# EAGLE design pcb-expérience (EAGLE 9.3.2)
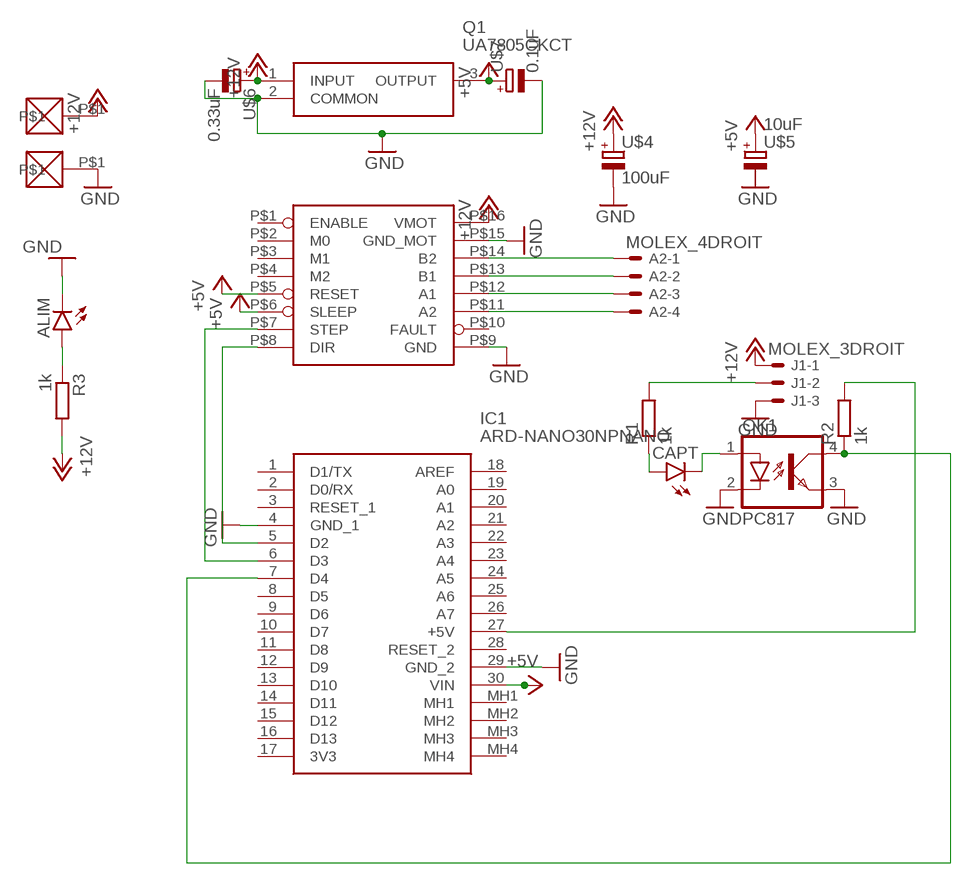
[diagram p0: schematic, sheet 1]

## Parts
A2  MOLEX_4DROIT  [CON_4_DROIT]
ALIM  LED5MM  [LED5MM]
CAPT  LED5MM  [LED5MM]
IC1  ARD-NANO30NPNANO  [ARDNANO30NP]
J1  MOLEX_3DROIT  [CON_3_DROIT]
OK1  PC817  [DIL04]
Q1  UA7805CKCT  [TO254P465X1016X1883-3P]
R1  1k  R-EU_0207/2V  [0207/2V]
R2  1k  R-EU_0207/7  [0207/7]
R3  1k  R-EU_0207/2V  [0207/2V]
U$1  DRV8825  [DRV8825]
U$2  BAT_WIRE_SOLD  [LARGE_PAD_BATT]
U$3  BAT_WIRE_SOLD  [LARGE_PAD_BATT]
U$4  100uF  CONDO3.5-8  [E3,5-8]
U$5  10uF  CONDO2-5  [E2-5]
U$6  0.33uF  CONDO2-5  [E2-5]
U$7  0.1uF  CONDO2-5  [E2-5]

## Nets
+5V: IC1.30(VIN) Q1.3(OUTPUT) U$1.P$5(RESET) U$1.P$6(SLEEP) U$5.+ U$7.+
+12V: J1.1 Q1.1(INPUT) R3.2 U$1.P$16(VMOT) U$2.P$1 U$4.+ U$6.+
GND: ALIM.K(C) IC1.4(GND_1) IC1.29(GND_2) J1.3 OK1.2(C) OK1.3(EMIT) Q1.2(COMMON) U$1.P$9(GND) U$1.P$15(GND_MOT) U$3.P$1 U$4.- U$6.- U$7.-
N$1: J1.2 R1.2
N$2: IC1.7(D4) OK1.4(COL) R2.1
N$3: IC1.27(+5V) R2.2
N$4: A2.4 U$1.P$11(A2)
N$5: A2.3 U$1.P$12(A1)
N$6: A2.2 U$1.P$13(B1)
N$7: A2.1 U$1.P$14(B2)
N$8: ALIM.A R3.1
N$9: CAPT.K(C) OK1.1(A)
N$10: CAPT.A R1.1
N$12: IC1.5(D2) U$1.P$8(DIR)
N$13: IC1.6(D3) U$1.P$7(STEP)
Unconnected: IC1.1(D1/TX) IC1.2(D0/RX) IC1.3(RESET_1) IC1.8(D5) IC1.9(D6) IC1.10(D7) IC1.11(D8) IC1.12(D9) IC1.13(D10) IC1.14(D11) IC1.15(D12) IC1.16(D13) IC1.17(3V3) IC1.18(AREF) IC1.19(A0) IC1.20(A1) IC1.21(A2) IC1.22(A3) IC1.23(A4) IC1.24(A5) IC1.25(A6) IC1.26(A7) IC1.28(RESET_2) IC1.MH1 IC1.MH2 IC1.MH3 IC1.MH4 U$1.P$1(ENABLE) U$1.P$2(M0) U$1.P$3(M1) U$1.P$4(M2) U$1.P$10(FAULT) U$5.-

## Library data of the parts
A2 = AREA:MOLEX_4: CONNECTOR wire to board 2.54 mm (.1 inch) pitch header; MF: MOLEX; OC_FARNELL: unknown; OC_NEWARK: unknown
ALIM CAPT = led:LED: LED OSRAM: - CHIPLED LG R971, LG N971, LY N971, LG Q971, LY Q971, LO R971, LY R971 LH N974, LH R974 LS Q976, LO Q976, LY Q976 LO Q996 - Hyper CHIPLED LW Q18S LB Q993, LB Q99A, LB R99A - SideLED LS A670, LO A670, LY A670, LG A670, LP A670 LB A673, LV A673, LT A673, LW A673 LH A674 LY A675 LS A676, LA A676, LO A676, LY A676, LW A676 LS A679, LY A679, LG A679 - Hyper Micro SIDELED® LS Y876, LA Y876, LO Y876, LY Y876 LT Y87S - SmartLED LW L88C, LW L88S LB L89C, LB L89S, LG L890 LS L89K, LO L89K, LY L89K LS L896, LA L896, LO L896, LY L896 - TOPLED LS T670, LO T670, LY T670, LG T670, LP T670 LSG T670, LSP T670, LSY T670, LOP T670, LYG T670 LG T671, LOG T671, LSG T671 LB T673, LV T673, LT T673, LW T673 LH T674 LS T676, LA T676, LO T676, LY T676, LB T676, LH T676, LSB T676, LW T676 LB T67C, LV T67C, LT T67C, LS T67K, LO T67K, LY T67K, LW E67C LS E67B, LA E67B, LO E67B, LY E67B, LB E67C, LV E67C, LT E67C LW T67C LS T679, LY T679, LG T679 LS T770, LO T770, LY T770, LG T770, LP T770 LB T773, LV T773, LT T773, LW T773 LH T774 LS E675, LA E675, LY E675, LS T675 LS T776, LA T776, LO T776, LY T776, LB T776 LHGB T686 LT T68C, LB T68C - Hyper Mini TOPLED® LB M676 - Mini TOPLED Santana® LG M470 LS M47K, LO M47K, LY M47K Source: http://www.osram.convergy.de LUXEON: - LUMILED® LXK2-PW12-R00, LXK2-PW12-S00, LXK2-PW14-U00, LXK2-PW14-V00 LXK2-PM12-R00, LXK2-PM12-S00, LXK2-PM14-U00 LXK2-PE12-Q00, LXK2-PE12-R00, LXK2-PE12-S00, LXK2-PE14-T00, LXK2-PE14-U00 LXK2-PB12-K00, LXK2-PB12-L00, LXK2-PB12-M00, LXK2-PB14-N00, LXK2-PB14-P00, LXK2-PB14-Q00 LXK2-PR12-L00, LXK2-PR12-M00, LXK2-PR14-Q00, LXK2-PR14-R00 LXK2-PD12-Q00, LXK2-PD12-R00, LXK2-PD12-S00 LXK2-PH12-R00, LXK2-PH12-S00 LXK2-PL12-P00, LXK2-PL12-Q00, LXK2-PL12-R00 Source: www.luxeon.com KINGBRIGHT: KA-3528ASYC Source: www.kingbright.com
IC1 = AREA:ARD-NANO30NP: Development Boards & Kits - AVR Arduino Nano 3.1 W/ATMEGA328 NO-PIN Source: Datasheet <http://www.mouser.com/datasheet/2/595/Arduino_Nano3_0-220057.pdf>; DESCRIPTION: Development Boards & Kits - AVR Arduino Nano 3.1 W/ATMEGA328 NO-PIN; HEIGHT: 5mm; MANUFACTURER_NAME: Gravitech; MANUFACTURER_PART_NUMBER: ARD-NANO30NP; MOUSER_PART_NUMBER: 992-ARD-NANO30NP; MOUSER_PRICE-STOCK: https://www.mouser.com/Search/Refine.aspx?Keyword=992-ARD-NANO30NP
J1 = AREA:MOLEX_3: CONNECTOR wire to board 2.54 mm (.1 inch) pitch header; MF: MOLEX; OC_FARNELL: unknown; OC_NEWARK: unknown
OK1 = AREA:PC817: SHARP OPTO COUPLER; MPN: PC817X4J000F; OC_FARNELL: 9707727; OC_NEWARK: 97K7059
Q1 = AREA:UA7805CKCT: Linear Voltage Regulator 5V 1.5A TO-220 Texas Instruments UA78xx UA7805CKCT, Single Linear Voltage Regulator, 1.5A 5 V, 3-Pin TO-220 Source: Datasheet <http://www.ti.com/lit/ds/symlink/ua7805.pdf>; DESCRIPTION: Linear Voltage Regulator 5V 1.5A TO-220 Texas Instruments UA78xx UA7805CKCT, Single Linear Voltage Regulator, 1.5A 5 V, 3-Pin TO-220; HEIGHT: 4.65mm; MANUFACTURER_NAME: Texas Instruments; MANUFACTURER_PART_NUMBER: UA7805CKCT; MOUSER_PART_NUMBER: 595-UA7805CKCT; MOUSER_PRICE-STOCK: https://www.mouser.com/Search/Refine.aspx?Keyword=595-UA7805CKCT; RS_PART_NUMBER: 8100161; RS_PRICE-STOCK: http://uk.rs-online.com/web/p/products/8100161
R1-R3 = rcl:R-EU_: RESISTOR, European symbol; SPICEPREFIX: R
U$1 = AREA:DRV8825
U$2 U$3 = AREA:BAT_WIRE_SOLD
U$4-U$7 = AREA:CONDO

## Board
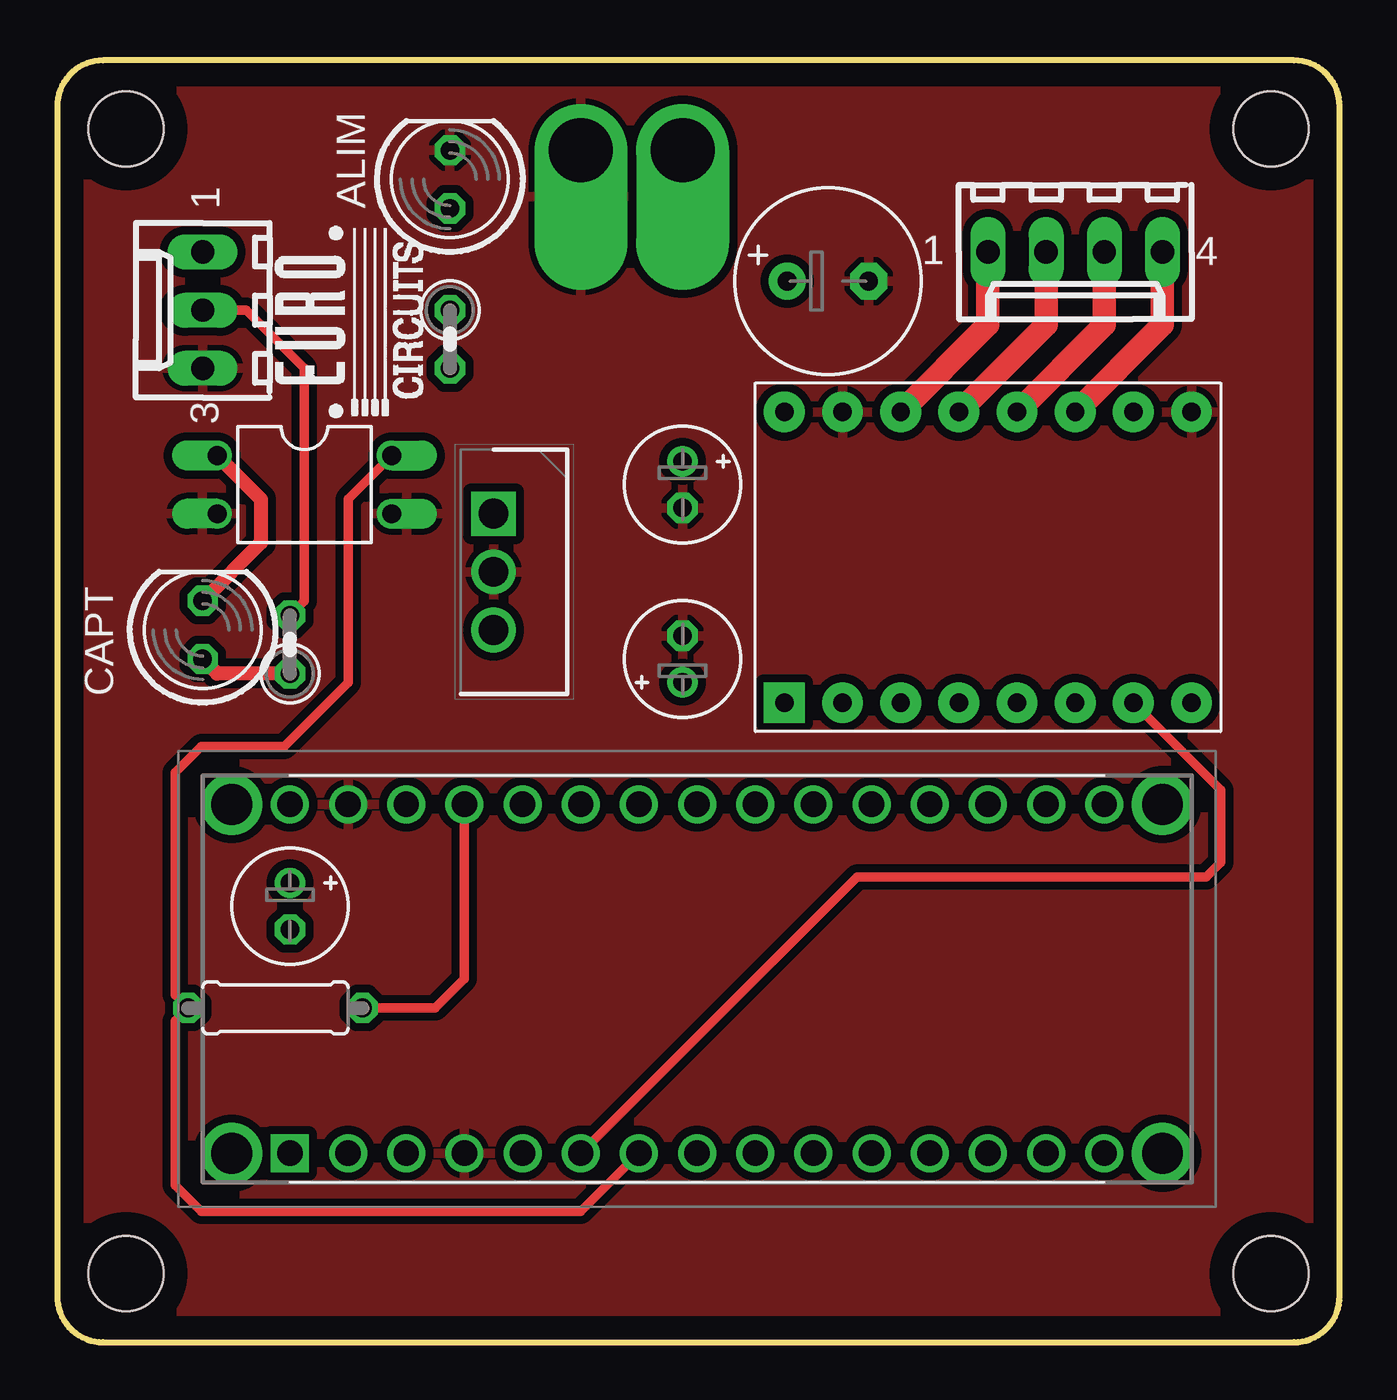
[diagram p1: board, top side]
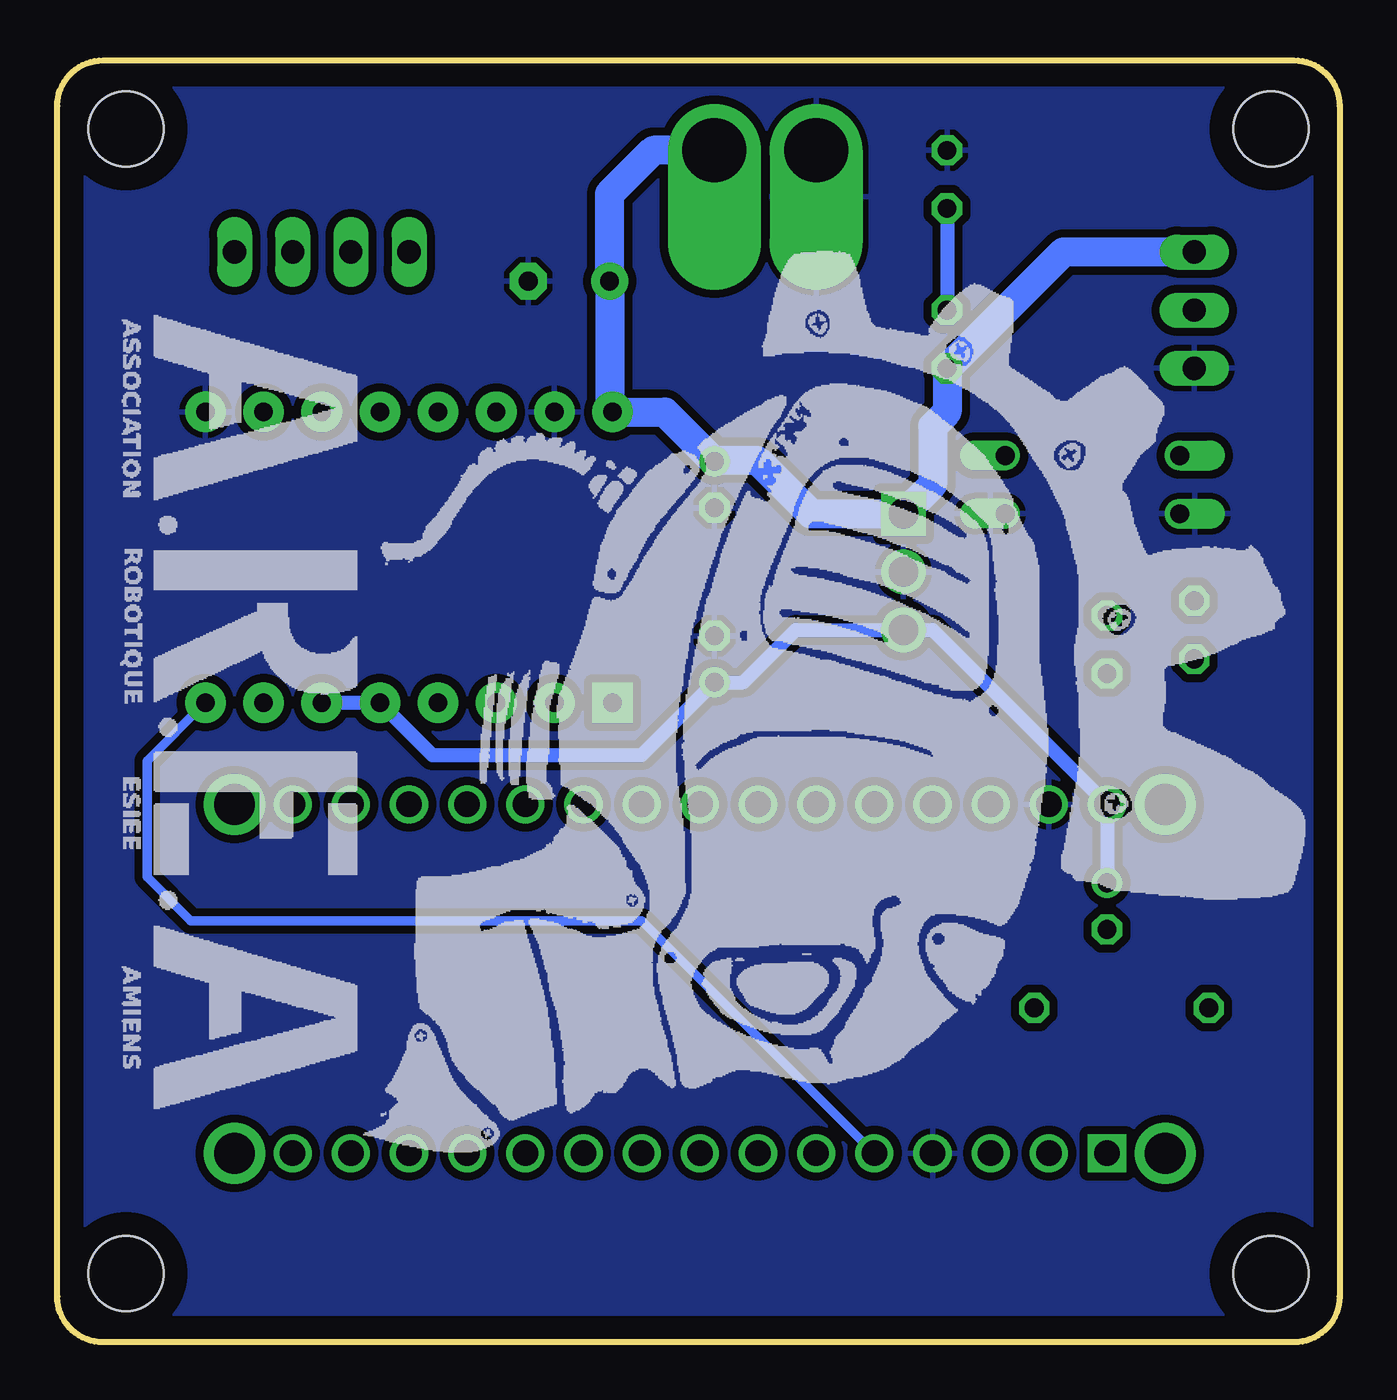
[diagram p2: board, bottom side, seen from below]

Size 56 x 56 mm. Coordinates in mm from the lower left corner, seen from the top.
Outline: 56,54 arc90 54,56 2,56 arc90 0,54 0,2 arc90 2,0 54,0 arc90 56,2 56,54
Copper layers (1*16): Top 0.035mm / dielectric 1.5mm / GND 0.035mm
Design rules "default *": minimum track width 14mil, minimum drill 0.35mm, track to track 14mil, track to pad 12mil, pad to pad 12mil, via to via 12mil, smd to smd 10mil, copper to edge 40mil, drill to drill 6mil, minimum pad ring 10mil, minimum via ring 8mil, stop-mask expansion 4mil, vias tented up to drill 0mil, thermal gap 10mil
Holes 3.3 mm at 53,3 53,53 3,3 3,53

### Footprints (pad centres in the part's own frame; a part is rotated, then mirrored left to right if it is on the bottom)
CON_4_DROIT = drill 1.016 long: 1 3.81,0; 2 1.27,0; 3 -1.27,0; 4 -3.81,0
LED5MM = drill 0.813 octagon: A -1.27,0; K 1.27,0
ARDNANO30NP = drill 1.11 pad 1.665 square: 1 0,0 | drill 1.11 pad 1.665: 2 0,-2.54; 3 0,-5.08; 4 0,-7.62; 5 0,-10.16; 6 0,-12.7; 7 0,-15.24; 8 0,-17.78; 9 0,-20.32; 10 0,-22.86; 11 0,-25.4; 12 0,-27.94; 13 0,-30.48; 14 0,-33.02; 15 0,-35.56; 16 15.24,-35.56; 17 15.24,-33.02; 18 15.24,-30.48; 19 15.24,-27.94; 20 15.24,-25.4; 21 15.24,-22.86; 22 15.24,-20.32; 23 15.24,-17.78; 24 15.24,-15.24; 25 15.24,-12.7; 26 15.24,-10.16; 27 15.24,-7.62; 28 15.24,-5.08; 29 15.24,-2.54; 30 15.24,0 | drill 1.778 pad 2.667: MH1 0,2.54; MH2 0,-38.1; MH3 15.24,-38.1; MH4 15.24,2.54
CON_3_DROIT = drill 1.016 long: 1 2.54,0; 2 0,0; 3 -2.54,0
DIL04 = drill 0.813 offset: 1 -1.27,-3.81; 2 1.27,-3.81; 3 1.27,3.81; 4 -1.27,3.81
TO254P465X1016X1883-3P = drill 1.3 pad 1.95 square: 1 0,0 | drill 1.3 pad 1.95: 2 2.54,0; 3 5.08,0
0207/2V = drill 0.813 octagon: 1 -1.27,0; 2 1.27,0
0207/7 = drill 0.813 octagon: 1 -3.81,0; 2 3.81,0
DRV8825 = drill 0.8 pad 1.778 square: P$1 0,0 | drill 0.8 pad 1.778: P$2 0,-2.54; P$3 0,-5.08; P$4 0,-7.62; P$5 0,-10.16; P$6 0,-12.7; P$7 0,-15.24; P$8 0,-17.78; P$9 12.7,-17.78; P$10 12.7,-15.24; P$11 12.7,-12.7; P$12 12.7,-10.16; P$13 12.7,-7.62; P$14 12.7,-5.08; P$15 12.7,-2.54; P$16 12.7,0
LARGE_PAD_BATT = drill 2.794 pad 4.064 offset: P$1 0,0
E3,5-8 = drill 0.813 pad 1.6: + -1.778,0 | drill 0.813 pad 1.6 octagon: - 1.778,0
E2-5 = drill 0.813 pad 1.27: + -1.016,0 | drill 0.813 pad 1.27 octagon: - 1.016,0

### Placement (x,y rotation side)
A2  44.45,47.62 180 top
ALIM  17.14,50.8 90 top
CAPT  6.35,31.11 90 top
IC1  10.16,8.26 90 top
J1  6.35,45.09 90 top
OK1  10.79,37.47 270 top
Q1  19.05,36.2 270 top
R1  10.16,30.48 90 top
R2  9.53,14.61 0 top
R3  17.14,43.81 270 top
U$1  31.75,27.94 90 top
U$2  27.3,52.07 180 top
U$3  22.86,52.07 180 top
U$4  33.66,46.35 0 top
U$5  10.16,19.05 270 top
U$6  27.3,37.47 270 top
U$7  27.3,29.84 90 top

### Tracks (layer width: path | path; a pad name or v marks a point on that pad's centre or on a via)
+5V
  GND 0.61: U$5.+ IC1.30 17.78,31.11 Q1.3 23.75,31.11 26.04,28.83 U$7.+ 30.48,25.65 39.62,25.65 U$1.P$5 U$1.P$6
+12V
  GND 1.27: U$2.P$1 29.97,52.07 31.88,50.16 U$4.+ 31.88,40.77 U$1.P$16 29.46,40.64 U$6.+ 27.25,38.53 25.43,38.53 23.1,36.2 Q1.1 17.78,37.47 17.78,40.01 17.14,40.64 R3.2 12.06,47.62 J1.1
GND
  pour GND: -12.06,-15.24 -12.06,73.03 57.78,73.03 57.78,-15.24
  pour Top: -15.88,-6.35 56.52,-6.35 56.52,64.77 -15.88,64.77
N$1
  Top 0.406: J1.2 8.26,45.09 10.79,42.55 10.79,32.38 R1.2
N$2
  Top 0.406: IC1.7 22.86,5.71 6.29,5.71 5.14,6.86 5.14,14.03 R2.1 5.14,15.18 5.14,24.89 6.29,26.04 9.91,26.04 12.7,28.83 12.7,36.83 OK1.4
N$3
  Top 0.406: R2.2 16.51,14.61 17.78,15.88 IC1.27
N$4
  Top 1.016: U$1.P$11 48.26,44.45 A2.4
N$5
  Top 1.016: U$1.P$12 45.72,44.45 A2.3
N$6
  Top 1.016: U$1.P$13 43.18,44.45 A2.2
N$7
  Top 1.016: U$1.P$14 40.64,44.45 A2.1
N$8
  GND 0.61: ALIM.A R3.1
N$9
  Top 0.61: CAPT.K 8.89,34.92 8.89,36.83 OK1.1
N$10
  Top 0.61: CAPT.A 6.99,29.21 R1.1
N$12
  GND 0.406: IC1.5 30.48,18.41 50.16,18.41 52.07,20.32 52.07,25.4 U$1.P$8
N$13
  Top 0.406: IC1.6 34.92,20.32 50.16,20.32 50.8,20.95 50.8,24.13 U$1.P$7